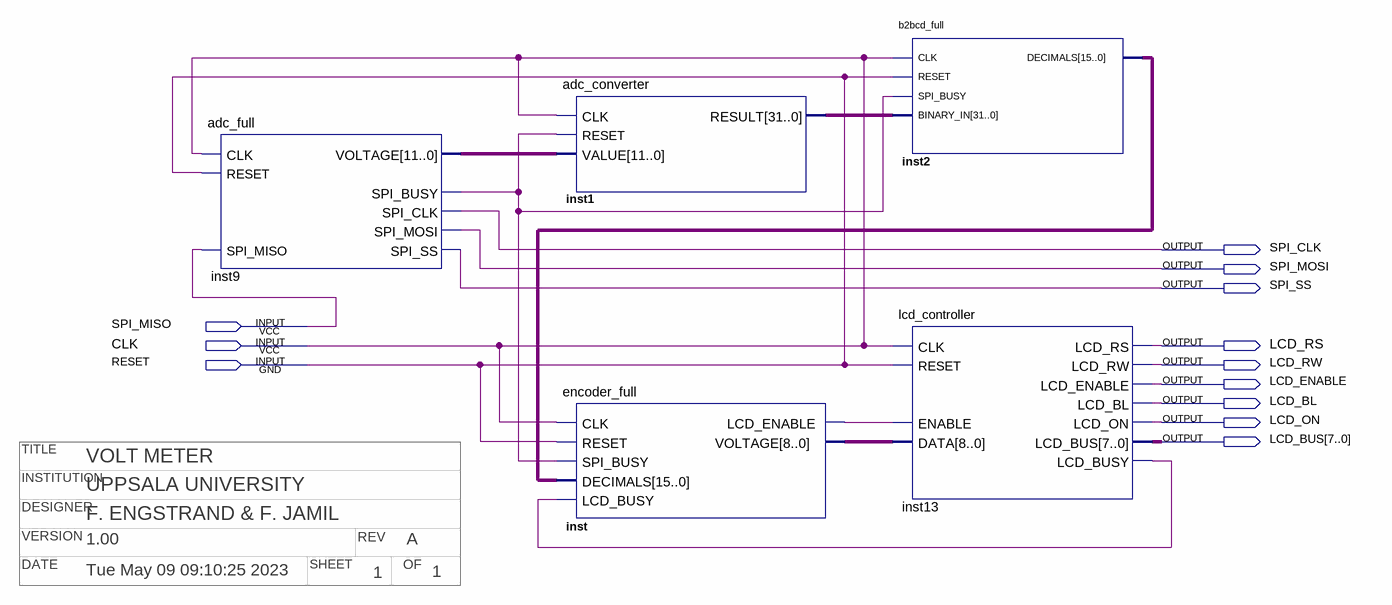
[diagram p0: schematic sheet]
// Quartus schematic volt-meter.bdf as structural Verilog: 5 symbols, 12 pins
// Title block: DATE: Tue May 09 09:10:25 2023; DESIGNER: F. ENGSTRAND & F. JAMIL; INSTITUTION: UPPSALA UNIVERSITY; OF: 1; REV: A; SHEET: 1; TITLE: VOLT METER; VERSION: 1.00
module \volt-meter  (
  input  SPI_MISO,
  input  CLK,
  input  RESET,
  output SPI_CLK,
  output SPI_MOSI,
  output SPI_SS,
  output LCD_RS,
  output LCD_RW,
  output LCD_ENABLE,
  output LCD_BL,
  output LCD_ON,
  output [7:0] LCD_BUS
);

  wire inst9_spi_busy, inst13_lcd_busy, inst_lcd_enable;
  wire [8:0] inst_voltage;
  wire [11:0] inst9_voltage;
  wire [15:0] inst2_decimals;
  wire [31:0] inst1_result;

  adc_full inst9 (
    .SPI_MISO(SPI_MISO), .RESET(RESET), .CLK(CLK), .SPI_MOSI(SPI_MOSI), .SPI_SS(SPI_SS), .SPI_CLK(SPI_CLK),
    .SPI_BUSY(inst9_spi_busy), .VOLTAGE(inst9_voltage));
  adc_converter inst1 (.CLK(CLK), .RESET(inst9_spi_busy), .VALUE(inst9_voltage), .RESULT(inst1_result));
  encoder_full inst (
    .CLK(CLK), .RESET(RESET), .SPI_BUSY(inst9_spi_busy), .DECIMALS(inst2_decimals),
    .LCD_BUSY(inst13_lcd_busy), .LCD_ENABLE(inst_lcd_enable), .VOLTAGE(inst_voltage));
  b2bcd_full inst2 (
    .CLK(CLK), .RESET(RESET), .SPI_BUSY(inst9_spi_busy), .BINARY_IN(inst1_result), .DECIMALS(inst2_decimals));
  lcd_controller inst13 (
    .CLK(CLK), .RESET(RESET), .ENABLE(inst_lcd_enable), .DATA(inst_voltage), .LCD_RS(LCD_RS),
    .LCD_RW(LCD_RW), .LCD_ENABLE(LCD_ENABLE), .LCD_BL(LCD_BL), .LCD_ON(LCD_ON), .LCD_BUS(LCD_BUS),
    .LCD_BUSY(inst13_lcd_busy));
endmodule
